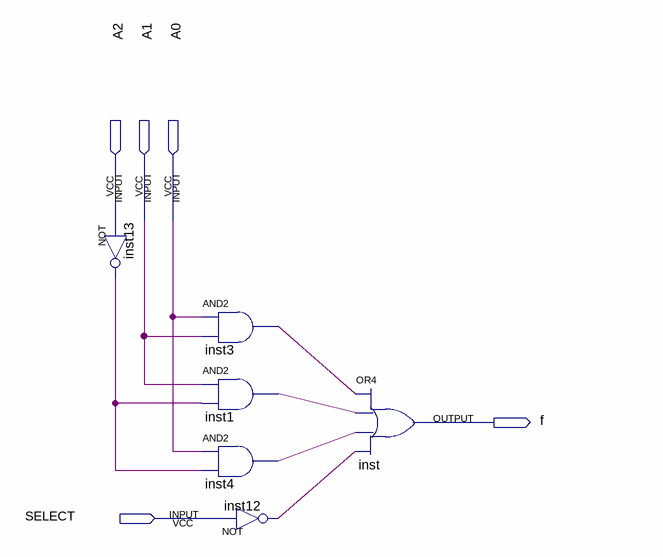
[diagram p0: schematic sheet]
// Quartus schematic segment_f.bdf as structural Verilog: 6 symbols, 5 pins
module segment_f (
  input  A2,
  input  A1,
  input  A0,
  input  SELECT,
  output f
);

  wire inst1_out, inst3_out, inst4_out, inst12_out, inst13_out;

  not inst13 (inst13_out, A2);
  and inst3 (inst3_out, A0, A1);
  and inst1 (inst1_out, A1, inst13_out);
  and inst4 (inst4_out, A0, inst13_out);
  not inst12 (inst12_out, SELECT);
  or inst (f, inst3_out, inst1_out, inst4_out, inst12_out);
endmodule
